# Altium schematic sheet [6] RgbLed.SchDoc: =DocumentName
size A3; Organization: ORGANIZATION; Address1: R. Aprígio Veloso, 882, Universitário; Address2: Campina Grande - PB; Address3: 58429-900; DocumentNumber: 6; Revision: -; SheetNumber: 6; SheetTotal: 9; ENG_DATE: --/--/--; DSN_DATE: --/--/--; CHK_DATE: --/--/--; SCH_SCALE: 1:1
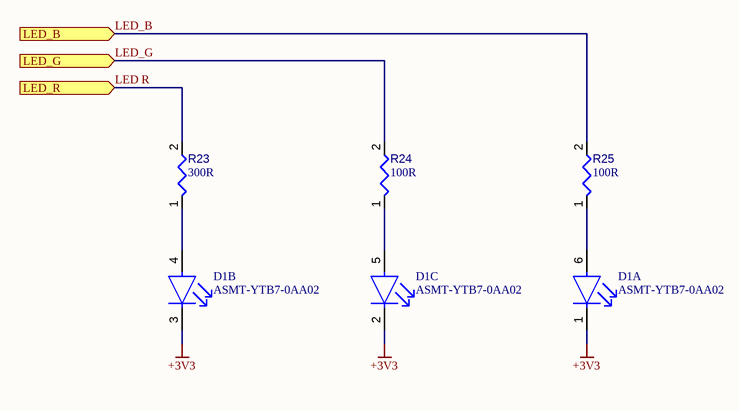
[diagram p0: [6] RgbLed.SchDoc]

## Parts
D1  ASMT-YTB7-0AA02  [FP-PLCC-6-MFG]  (parts A,B,C of 3)
R23  value 300R  [RESC0603(1608)_L]  (hidden comment: ERJ-3GEYJ301V)
R24  value 100R  [RESC0603(1608)_L]  (hidden comment: ERJ-3EKF1000V)
R25  value 100R  [RESC0603(1608)_L]  (hidden comment: ERJ-3EKF1000V)

## Ports
LED_B (in), LED_G (in), LED_R (in)

## Nets
+3V3: D1.1(Cathode(Blue)) D1.2(Cathode(Green)) D1.3(Cathode(Red))
LED R: R23.2 ; port LED_R
LED_B: R25.2 ; port LED_B
LED_G: R24.2 ; port LED_G
NetD1_4: D1.4(Anode(Red)) R23.1
NetD1_5: D1.5(Anode(Green)) R24.1
NetD1_6: D1.6(Anode(Blue)) R25.1

## Notes on the sheet
- REVISION
- DESCRIPTION
- DATE
- APPROVED
- ADDRESS
- PROJECT
- VERSION
- TITLE
- A3
- SIZE
- SCALE
- DOCUMENT NAME:
- DOCUMENT REVISION:
- OF
- SHEET:
- PROJECT REVISION:

## Library data of the parts
D1 = CMP-007-00036-1: LED Tri-Color Blue/Green/Red 469nm/529nm/623nm Chip LED 6-Pin PLCC T/R; Lens Size: 2.3mm; Forward Voltage: 3.1V; Lens Transparency: Diffused; Dominant Wavelength: 469nm; Luminous Intensity: 384mcd; Viewing Angle: 120°; Color: Blue,Green,Red; Lens Style: Flat,Square,Diffused,Rectangular; Reverse Voltage: 4V; Number of LEDs: 3; Forward Current: 20mA; Reach SVHC Compliant: No; Case/Package: PLCC; Packaging: Cut Tape; Orientation: Top View; Height: 2mm; Length: 3mm; Contact Plating: Silver; Weight: 40mg; Min Operating Temperature: -40°C; Pins: 6; Series: -; Max Operating Temperature: 100°C; Package Quantity: 2000; Mounting Technology: Surface Mount; Width: 2.8mm; Test Current: 20mA
R23 = CMP-009-00189-1: Res Thick Film 0603 300 Ohm 5% 1/10W ±200ppm/°C Molded SMD Punched Carrier T/R; Power Rating: 100mW; Voltage Rating (DC): 75V; Case Code (Metric): 1608; Termination: SMD/SMT; Series: ERJ; Package Quantity: 1; Case/Package: 0603; Reach SVHC Compliant: Unknown; Min Operating Temperature: -55°C; Contact Plating: Tin; Lead Free: Lead Free; Construction: Rectangular; Height: 0.45mm; Resistance Tolerance: 5%; Technology: THICK FILM; Width: 0.8mm; Max Operating Temperature: 155°C; Number of Terminations: 2; Case Code (Imperial): 0603; Pins: 2; Resistor Type: Thick Film; Voltage Rating: 75V; Length: 1.6mm; RoHS Compliant: Yes; Temperature Coefficient: 200ppm/°C; Features: Automotive AEC-Q200; Max Power Dissipation: 100mW; Military Standard: Not; Depth: 0.8mm; Weight: 7.1E-05oz; Tolerance: 5%; Radiation Hardening: No; Packaging: Tape and Reel; Mounting Technology: Surface Mount
R24 R25 = CMP-009-00188-1: SMD Chip Resistor, 100 Ohm, ï¿½ 1%, 100 mW, 0603 [1608 Metric], Thick Film, Precision; Max Power Dissipation: 100mW; Voltage Rating (DC): 75V; Temperature Coefficient: 100ppm/°C; Case Code (Metric): 1608; Radiation Hardening: No; Resistance Tolerance: 1%; Packaging: Tape and Reel; Contact Plating: Tin; Tolerance: 1%; RoHS Compliant: Yes; Termination: SMD/SMT; Resistor Type: Thick Film; Military Standard: Not; Series: ERJ; Mounting Technology: Surface Mount; Weight: 7.1E-05oz; Number of Terminations: 2; Case/Package: 0603; Package Quantity: 5000; Case Code (Imperial): 0603; Width: 0.8mm; Min Operating Temperature: -55°C; Max Operating Temperature: 155°C; Construction: Rectangular; Height: 0.45mm; Power Rating: 100mW; Length: 1.6mm; Lead Free: Lead Free; Voltage Rating: 75V; Reach SVHC Compliant: No; Features: Automotive AEC-Q200; Depth: 0.8mm